# Altium schematic sheet Integrators_SarSol.SchDoc
size Tabloid; SheetNumber: 5; SheetTotal: 6
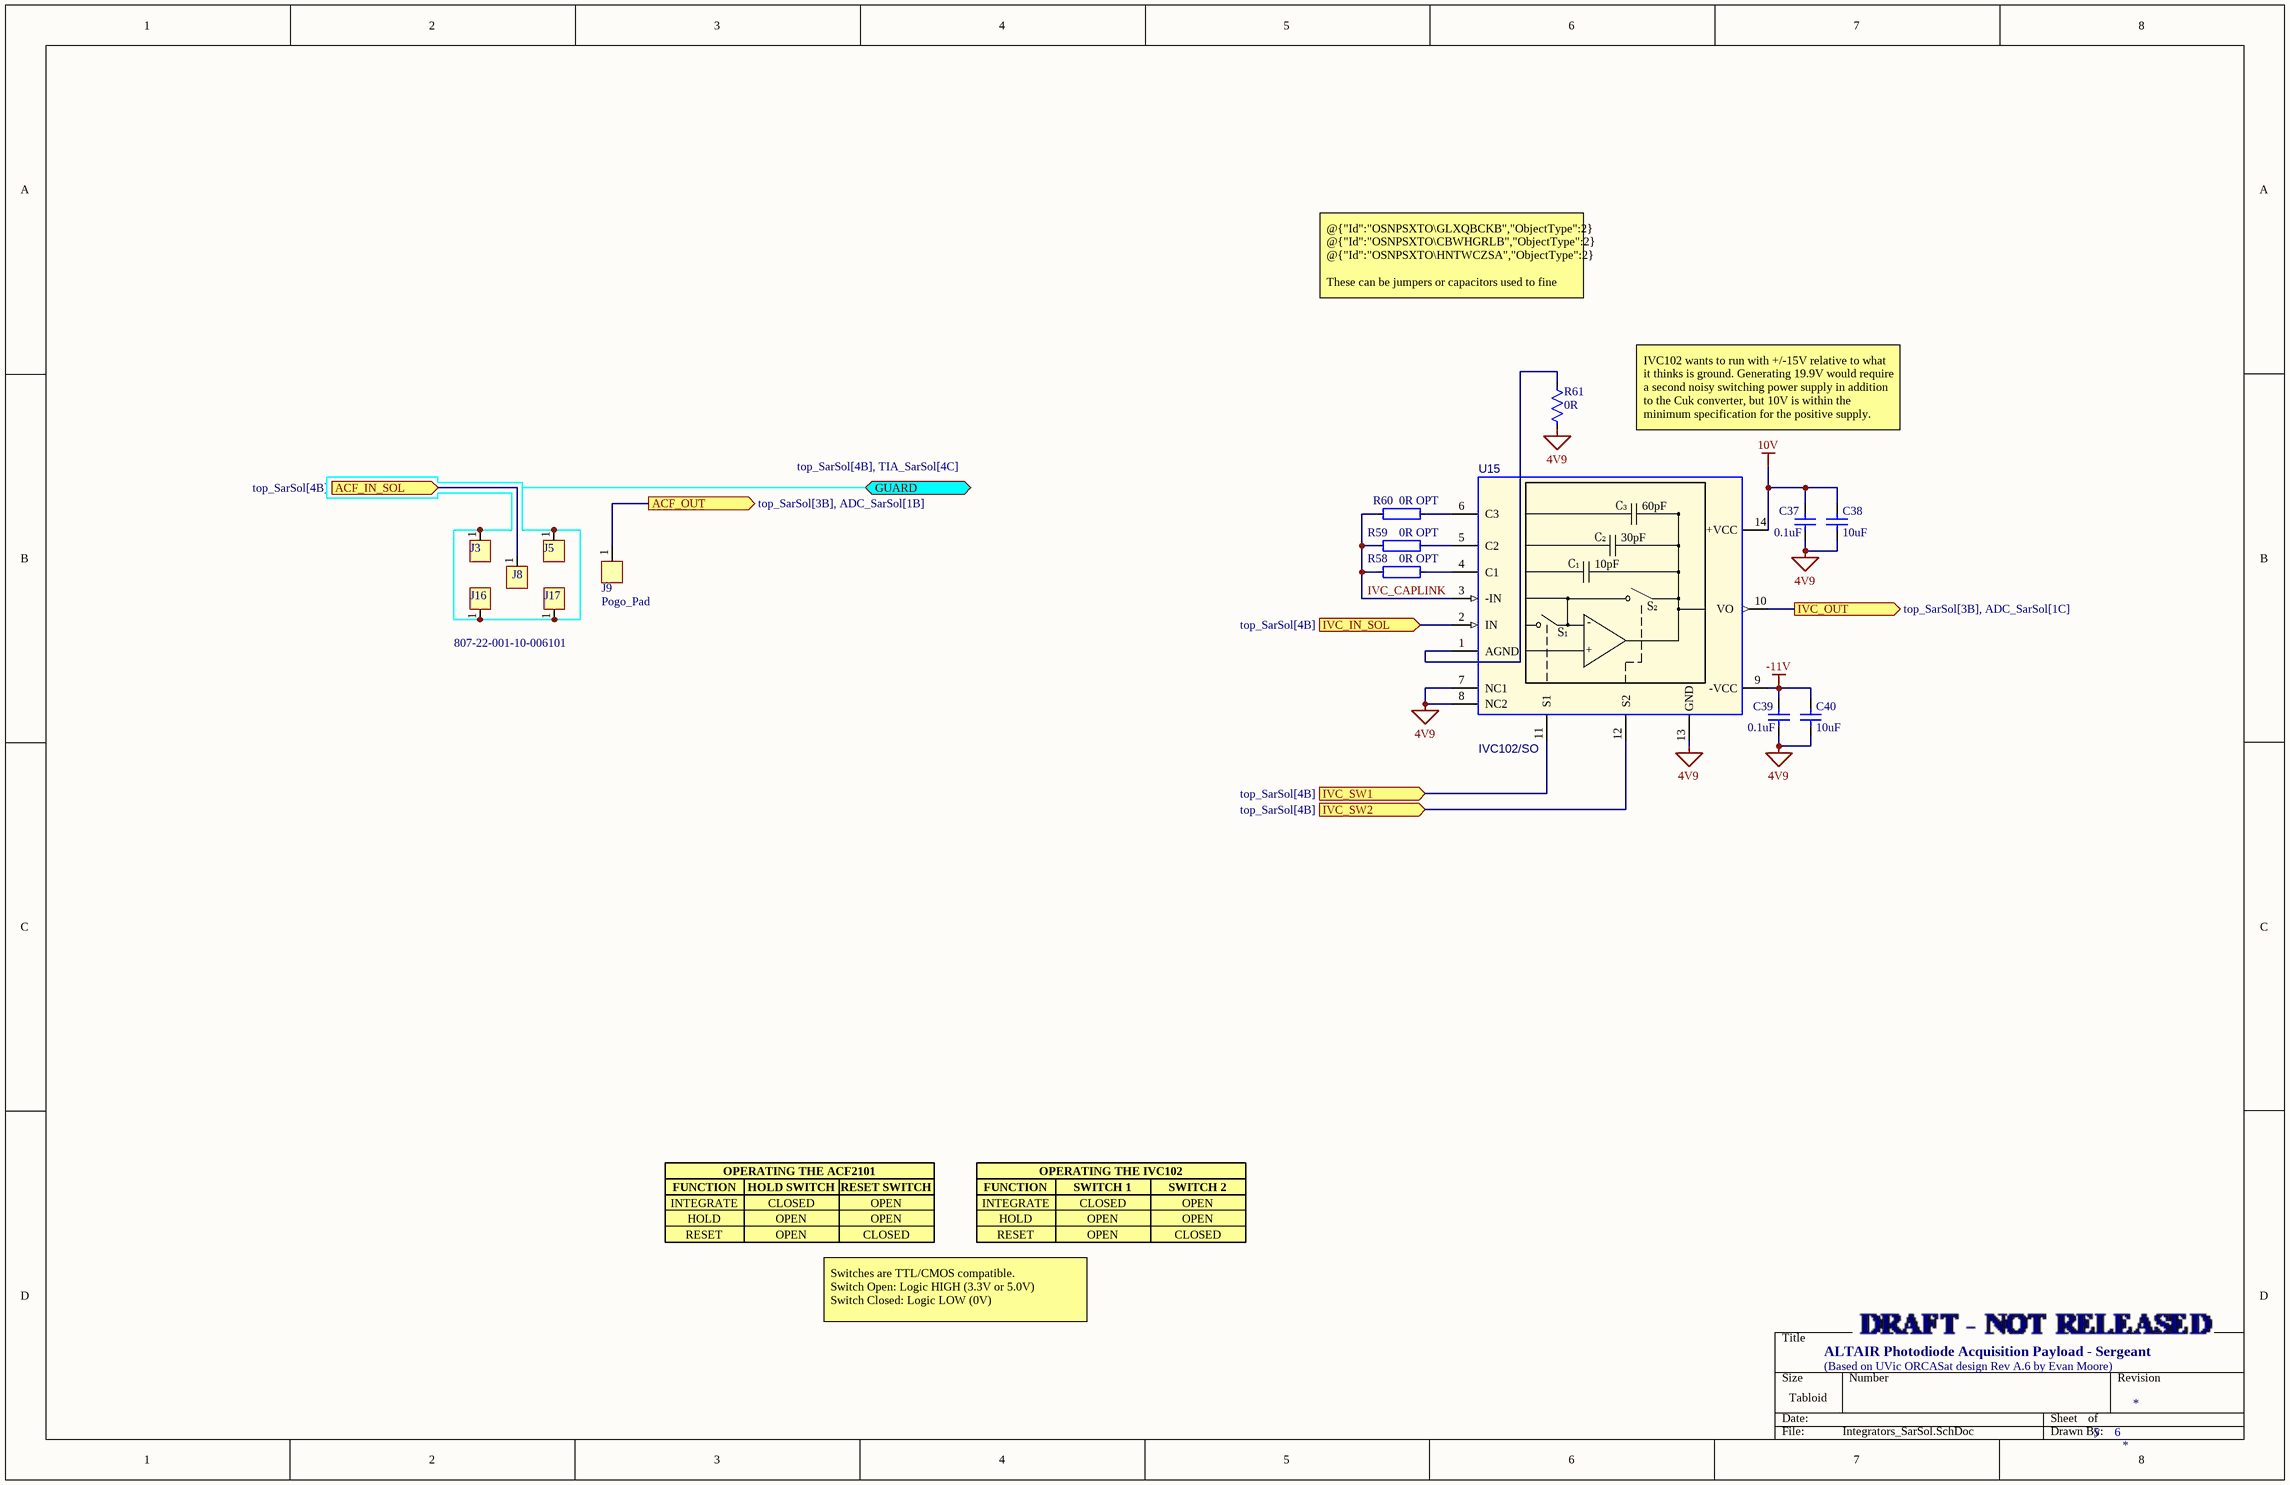
[diagram p0: Integrators_SarSol.SchDoc]

## Parts
C37  0.1uF  [CAP 0603 NON-IPC KEMET X7R]
C38  10uF  [CAP 0805 IPC MID DENSITY]
C39  0.1uF  [CAP 0603 NON-IPC KEMET X7R]
C40  10uF  [CAP 0805 IPC MID DENSITY]
J3  807-22-001-10-006101  [POGO PIN 807-22-001-10-006101]  (value not drawn)
J5  807-22-001-10-006101  [POGO PIN 807-22-001-10-006101]  (value not drawn)
J8  807-22-001-10-006101  [POGO PIN 807-22-001-10-006101]
J9  Pogo_Pad  [POGO PAD SOLDIER]  (no BOM)
J16  807-22-001-10-006101  [POGO PIN 807-22-001-10-006101]  (value not drawn)
J17  807-22-001-10-006101  [POGO PIN 807-22-001-10-006101]  (value not drawn)
R58  0R OPT  [RES 0402 IPC LOW DENSITY]
R59  0R OPT  [RES 0402 IPC LOW DENSITY]
R60  0R OPT  [RES 0402 IPC LOW DENSITY]
R61  0R  [RES 0402 IPC MID DENSITY]
U15  IVC102/SO  [14-SOIC 4MM WIDE LOW DENSITY]

## Ports
ACF_IN_SOL (in, see top_SarSol[4B]), ACF_OUT (out, see top_SarSol[3B], ADC_SarSol[1B]), GUARD (bidir, see top_SarSol[4B], TIA_SarSol[4C]), IVC_IN_SOL (in, see top_SarSol[4B]), IVC_OUT (out, see top_SarSol[3B], ADC_SarSol[1C]), IVC_SW1 (in, see top_SarSol[4B]), IVC_SW2 (in, see top_SarSol[4B])

## Nets
4V9: C37.1 C38.1 C39.1 C40.1 R61.2 U15.7(NC1) U15.8(NC2) U15.13(GND)
10V: C37.2 C38.2 U15.14(+VCC)
-11V: C39.2 C40.2 U15.9(-VCC)
ACF_IN_SOL: J8.1 ; port ACF_IN_SOL
ACF_OUT: J9.1 ; port ACF_OUT
GUARD: J3.1 J5.1 J16.1 J17.1 ; port GUARD
IVC_CAPLINK: R58.1 R59.1 R60.1 U15.3(-IN)
IVC_IN_SOL: U15.2(IN) ; port IVC_IN_SOL
IVC_OUT: U15.10(VO) ; port IVC_OUT
IVC_SW1: U15.11(S1) ; port IVC_SW1
IVC_SW2: U15.12(S2) ; port IVC_SW2
NetR58_2: R58.2 U15.4(C1)
NetR59_2: R59.2 U15.5(C2)
NetR60_2: R60.2 U15.6(C3)
NetR61_1: R61.1 U15.1(AGND)

## Notes on the sheet
- @{"Id":"OSNPSXTO\GLXQBCKB","ObjectType":2} @{"Id":"OSNPSXTO\CBWHGRLB","ObjectType":2} @{"Id":"OSNPSXTO\HNTWCZSA","ObjectType":2}
  These can be jumpers or capacitors used to fine tune the IVC's response. At least one must be populated to close the op-amp feedback loop.
- IVC102 wants to run with +/-15V relative to what it thinks is ground. Generating 19.9V would require a second noisy switching power supply in addition to the Cuk converter, but 10V is within the minimum specification for the positive supply.
- FUNCTION
- INTEGRATE
- HOLD
- RESET
- OPERATING THE ACF2101
- HOLD SWITCH
- CLOSED
- OPEN
- RESET SWITCH
- OPERATING THE IVC102
- SWITCH 1
- SWITCH 2
- Switches are TTL/CMOS compatible.
  Switch Open: Logic HIGH (3.3V or 5.0V)
  Switch Closed: Logic LOW (0V)
- ALTAIR Photodiode Acquisition Payload - Sergeant
- (Based on UVic ORCASat design Rev A.6 by Evan Moore)
- (in symbol IVC102/SO_5) C₃; 60pF; C₂; 30pF; C₁; 10pF; S₂; -; S₁; +

## Library data of the parts
C37 C39 = CAP: Kemet C0603C104K5RACAUTO - Cap Ceramic 0.1uF 50V X7R 10% 0603 125C Paper T/R; MF: Kemet; MP: C0603C104K5RACAUTO
C38 C40 = CAP: Murata GRM21BR61E106KA73L - Cap Ceramic 10uF 10% 25V X5R 0805; MF: Murata; MP: GRM21BR61E106KA73L
J3 J5 J8 J16 J17 = 807-22-001-10-006101: Mill-Max Individual Insulated Pin 5.99mm Initial Height; MF: Mill-Max; MP: 807-22-001-10-006101
J9 = Pogo_Pad_NoGuard: Pad for Pogo Pin without Guard
R58-R60 = IMPEDANCE: Yageo RC0402JR-070RL - Res 0 Ohms 1/16W SMD 0402; MF: YAGEO; MP: RC0402JR-070RL
R61 = RES: Yageo RC0402JR-070RL - Res 0 Ohms 1/16W SMD 0402; MF: YAGEO; MP: RC0402JR-070RL
U15 = IVC102/SO_5: Precision Switched Integrator Transimpedance Amplifier; Part Reference: U1; MF: Texas Instruments; MP: IVC102U; Value: IVC102/SO